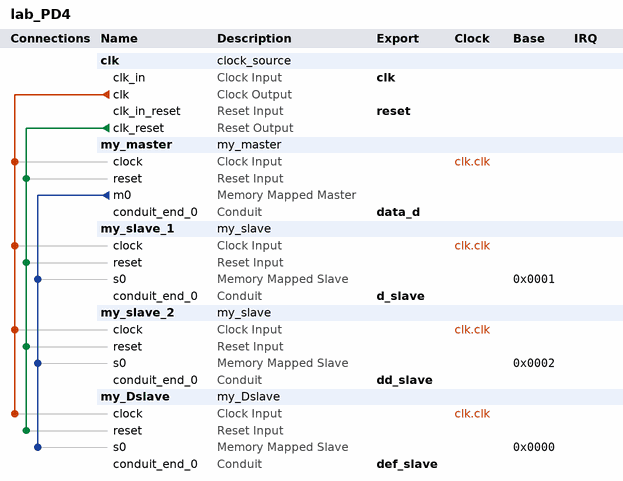
[diagram p0: system contents]
# Platform Designer (Qsys) system lab_PD4, Cyclone IV E EP4CE6E22C8
# Parameters at their usual value, and those the tool derives, are not listed.
package require -exact qsys 20.1
create_system lab_PD4
set_project_property DEVICE_FAMILY {Cyclone IV E}
set_project_property DEVICE EP4CE6E22C8

add_instance clk clock_source 20.1
set_instance_parameter_value clk clockFrequency 50000000
set_instance_parameter_value clk resetSynchronousEdges DEASSERT

add_instance my_master my_master 1.0

add_instance my_slave_1 my_slave 1.0

add_instance my_slave_2 my_slave 1.0

add_instance my_Dslave my_Dslave 1.0

# connections
add_connection clk.clk my_Dslave.clock clock
add_connection clk.clk my_master.clock clock
add_connection clk.clk my_slave_1.clock clock
add_connection clk.clk my_slave_2.clock clock
add_connection clk.clk_reset my_Dslave.reset reset
add_connection clk.clk_reset my_master.reset reset
add_connection clk.clk_reset my_slave_1.reset reset
add_connection clk.clk_reset my_slave_2.reset reset
add_connection my_master.m0 my_Dslave.s0 avalon
set_connection_parameter_value my_master.m0/my_Dslave.s0 baseAddress 0x0000
set_connection_parameter_value my_master.m0/my_Dslave.s0 defaultConnection true
add_connection my_master.m0 my_slave_1.s0 avalon
set_connection_parameter_value my_master.m0/my_slave_1.s0 baseAddress 0x0001
add_connection my_master.m0 my_slave_2.s0 avalon
set_connection_parameter_value my_master.m0/my_slave_2.s0 baseAddress 0x0002

# exported interfaces
add_interface clk clock sink
set_interface_property clk EXPORT_OF clk.clk_in
add_interface d_slave conduit end
set_interface_property d_slave EXPORT_OF my_slave_1.conduit_end_0
add_interface data_d conduit end
set_interface_property data_d EXPORT_OF my_master.conduit_end_0
add_interface dd_slave conduit end
set_interface_property dd_slave EXPORT_OF my_slave_2.conduit_end_0
add_interface def_slave conduit end
set_interface_property def_slave EXPORT_OF my_Dslave.conduit_end_0
add_interface reset reset sink
set_interface_property reset EXPORT_OF clk.clk_in_reset

set_interconnect_requirement {$system} qsys_mm.clockCrossingAdapter HANDSHAKE
set_interconnect_requirement {$system} qsys_mm.enableEccProtection FALSE
set_interconnect_requirement {$system} qsys_mm.insertDefaultSlave FALSE
set_interconnect_requirement {$system} qsys_mm.maxAdditionalLatency 1

save_system lab_PD4.qsys
